# EAGLE design Qwiic_TMF8801 (EAGLE 9.6.2)
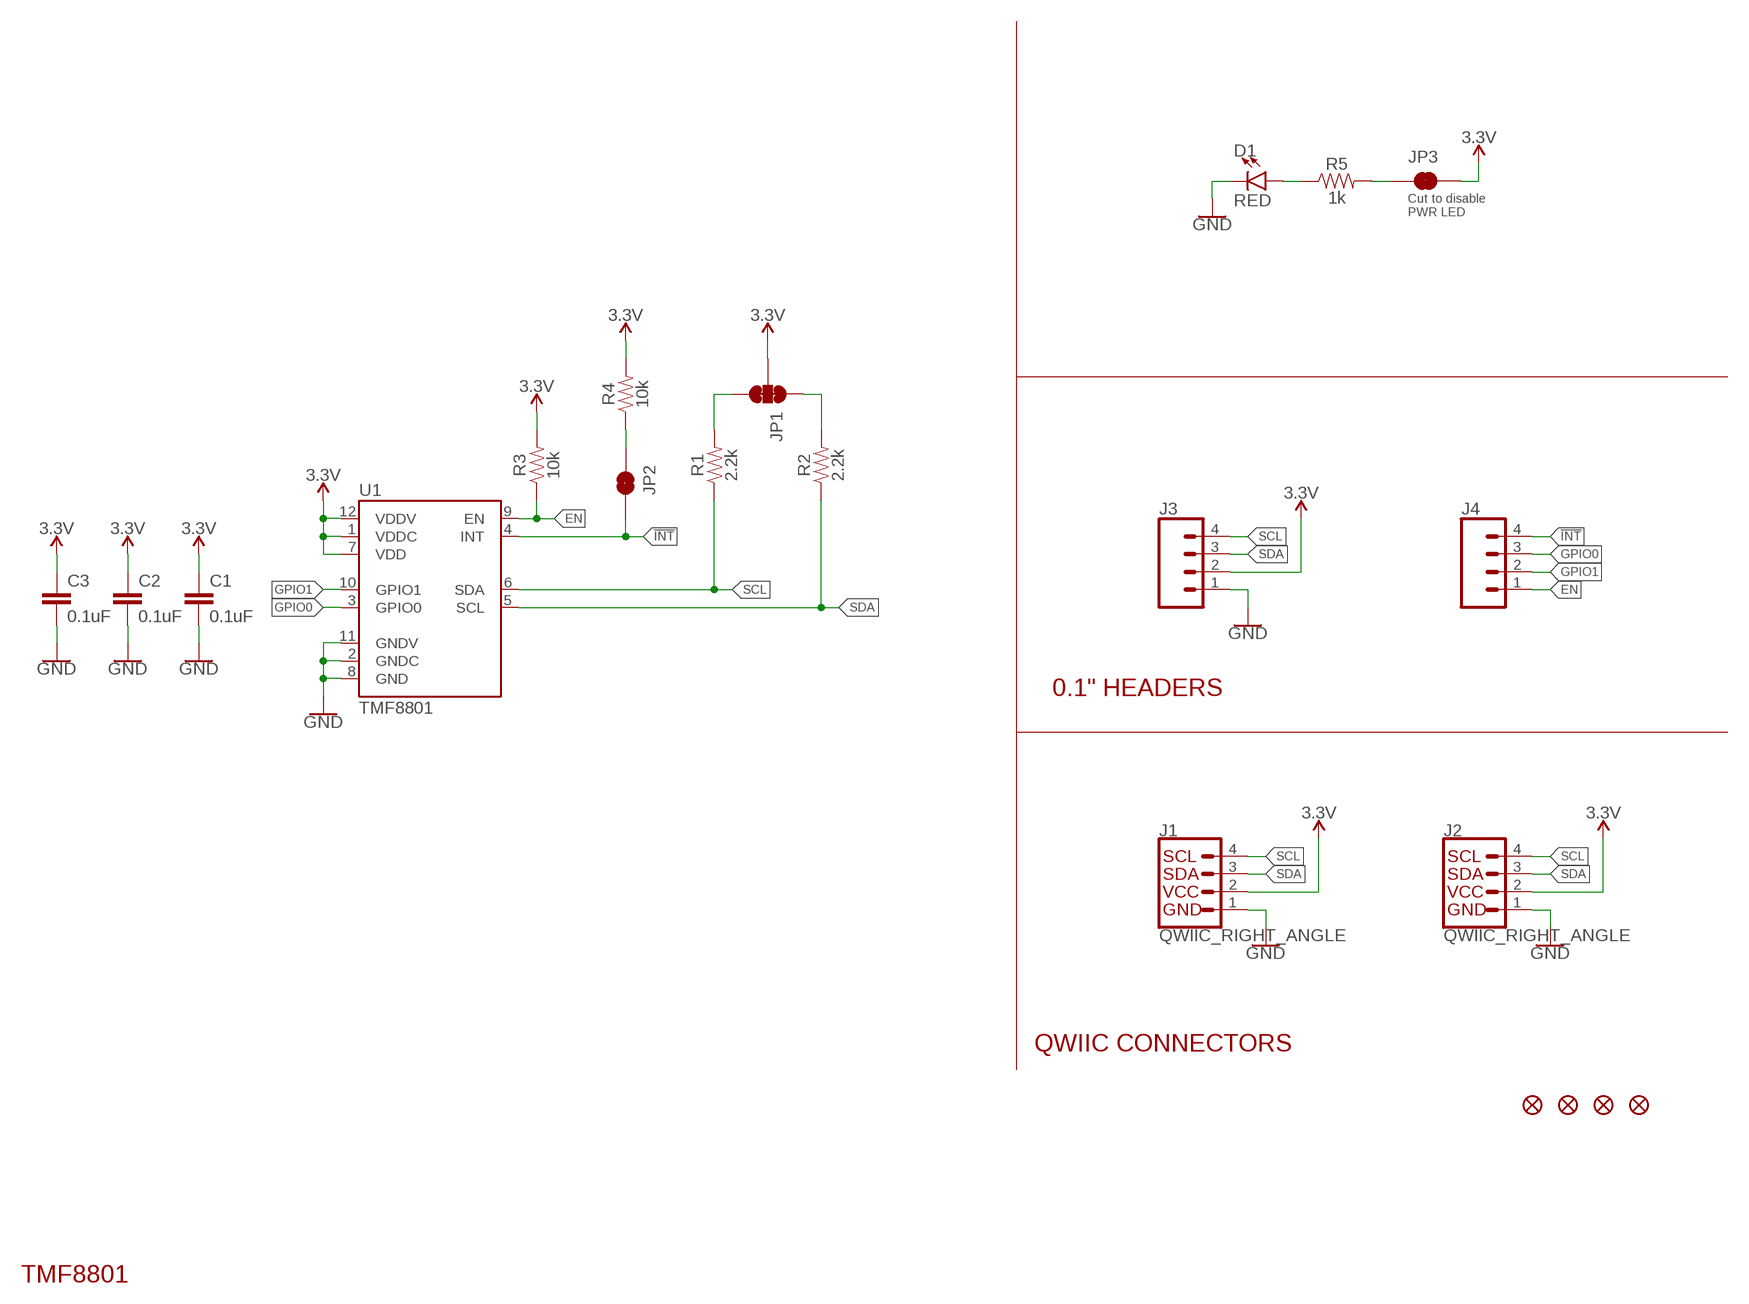
[diagram p0: schematic, sheet 1]

## Parts
C1  0.1uF  0.1UF-0603-25V-(+80/-20%)  [0603]
C2  0.1uF  0.1UF-0603-25V-(+80/-20%)  [0603]
C3  0.1uF  0.1UF-0603-25V-(+80/-20%)  [0603]
D1  RED  LED-RED0603  [LED-0603]
FD1  FIDUCIAL1X2  [FIDUCIAL-1X2]
FD2  FIDUCIAL1X2  [FIDUCIAL-1X2]
FD3  FIDUCIAL1X2  [FIDUCIAL-1X2]
FD4  FIDUCIAL1X2  [FIDUCIAL-1X2]
J1  QWIIC_RIGHT_ANGLE  QWIIC_CONNECTORJS-1MM  [JST04_1MM_RA]
J2  QWIIC_RIGHT_ANGLE  QWIIC_CONNECTORJS-1MM  [JST04_1MM_RA]
J3  CONN_041X04_NO_SILK  [1X04_NO_SILK]
J4  CONN_041X04_NO_SILK  [1X04_NO_SILK]
JP1  JUMPER-SMT_3_2-NC_TRACE_SILK  [SMT-JUMPER_3_2-NC_TRACE_SILK]
JP2  JUMPER-SMT_2_NC_TRACE_SILK  [SMT-JUMPER_2_NC_TRACE_SILK]
JP3  JUMPER-SMT_2_NC_TRACE_SILK  [SMT-JUMPER_2_NC_TRACE_SILK]
R1  2.2k  2.2KOHM-0603-1/10W-1%  [0603]
R2  2.2k  2.2KOHM-0603-1/10W-1%  [0603]
R3  10k  10KOHM-0603-1/10W-1%  [0603]
R4  10k  10KOHM-0603-1/10W-1%  [0603]
R5  1k  1KOHM-0603-1/10W-1%  [0603]
U1  TMF8801  TMF8801TMF8801  [TMF8801-CUSTOM]

## Nets
3.3V: C1.1 C2.1 C3.1 J1.2 J2.2 J3.2 JP1.2 JP3.2 R3.2 R4.2 U1.1(VDDC) U1.7(VDD) U1.12(VDDV)
!INT: J4.4 JP2.2 U1.4(INT)
EN: J4.1 R3.1 U1.9(EN)
GND: C1.2 C2.2 C3.2 D1.C J1.1 J2.1 J3.1 U1.2(GNDC) U1.8(GND) U1.11(GNDV)
GPIO0: J4.3 U1.3(GPIO0)
GPIO1: J4.2 U1.10(GPIO1)
N$1: D1.A R5.1
N$2: JP1.3 R1.2
N$3: JP1.1 R2.2
N$4: JP3.1 R5.2
N$5: JP2.1 R4.1
SCL: J1.4 J2.4 J3.4 R1.1 U1.6(SDA)
SDA: J1.3 J2.3 J3.3 R2.1 U1.5(SCL)

## Notes on the sheet
- Cut to disable
  PWR LED
- 0.1" HEADERS
- QWIIC CONNECTORS
- TMF8801

## Library data of the parts
C1-C3 = SparkFun-Capacitors:0.1UF: 0.1µF ceramic capacitors A capacitor is a passive two-terminal electrical component used to store electrical energy temporarily in an electric field.; PROD_ID: CAP-00810
D1 = SparkFun-LED:LED-RED: Red SMD LED Used in manufacturing of most products at SparkFun Packages: 0603 - SMD 0603 package [Product Link] <http://docs.avagotech.com/docs/AV02-0551EN> 0603 SMART - SMD 0603 SMART package ( more efficient and expensive)[Product Link] <http://www.osram-os.com/Graphics/XPic2/00077099_0.pdf> 1206 - SMD1206 package [Product Link] <https://www.sparkfun.com/datasheets/DevTools/LilyPad/Q150OVS4.pdff> SparkFun Products: Pro Mini 328 -5V <https://www.sparkfun.com/products/821> RedBoard <https://www.sparkfun.com/products/12757> IOIO-OTG <https://www.sparkfun.com/products/13613>; PROD_ID: DIO-00819
FD1-FD4 = SparkFun-Aesthetics:FIDUCIAL: Fiducial Alignment Points Point-of-reference for pick-and-place machines and other optical instruments.
J1 J2 = SparkFun-Connectors:QWIIC_CONNECTOR: SparkFun I2C Standard Qwiic Connector An SMD 1mm pitch JST connector makes it easy and quick (get it? Qwiic?) to connect I2C devices to each other. The Qwiic system <http://www.sparkfun.com/qwiic> enables fast and solderless connection between popular platforms and various sensors and actuators. We carry 200mm <https://www.sparkfun.com/products/14204>, 100mm <https://www.sparkfun.com/products/14205>, 50mm <https://www.sparkfun.com/products/14206>, and breadboard friendly <https://www.sparkfun.com/products/14207> Qwiic cables. We also offer 10 pcs strips <https://www.sparkfun.com/products/14323> the SMD connectors.; PROD_ID: CONN-13694
J3 J4 = SparkFun-Connectors:CONN_04: Multi connection point. Often used as Generic Header-pin footprint for 0.1 inch spaced/style header connections On any of the 0.1 inch spaced packages, you can populate with these: Break Away Headers - Straight <https://www.sparkfun.com/products/116> (PRT-00116) Break Away Male Headers - Right Angle <https://www.sparkfun.com/products/553> (PRT-00553) Female Headers <https://www.sparkfun.com/products/115> (PRT-00115) Break Away Headers - Machine Pin <https://www.sparkfun.com/products/117> (PRT-00117) Break Away Female Headers - Swiss Machine Pin <https://www.sparkfun.com/products/743> (PRT-00743) For SCREWTERMINALS and SPRING TERMINALS visit here: Screw Terimnals on SparkFun.com <https://www.sparkfun.com/search/results?term=Screw+Terminals> (5mm/3.5mm/2.54mm spacing) This device is also useful as a general connection point to wire up your design to another part of your project. Our various solder wires solder well into these plated through hole pads. Hook-Up Wire - Assortment (Stranded, 22 AWG) <https://www.sparkfun.com/products/11375> (PRT-11375) Hook-Up Wire - Assortment (Solid Core, 22 AWG) <https://www.sparkfun.com/products/11367> (PRT-11367) View the entire wire category on our website here <https://www.sparkfun.com/categories/141> Special notes: Molex polarized connector foot print use with SKU : PRT-08231 with associated crimp pins and housings. 1MM SMD Version SKU: PRT-10208; PROD_ID: CONN-09696
JP1 = SparkFun-Jumpers:JUMPER-SMT_3_2-NC_TRACE: Normally closed trace jumper (2 of 2 connections) This jumper has a trace between all three pads so they are normally closed (NC). Use a razor knife to open the connection(s). For best results follow the IPC guidelines for cutting traces: Cutout at least 0.063 mm (0.005 in). Remove all loose material to clean up the cut area. Seal the cut with an approved epoxy. Reapply solder to reclose the connection(s).
JP2 JP3 = SparkFun-Jumpers:JUMPER-SMT_2_NC_TRACE: Normally closed trace jumper This jumper has a trace between two pads so it's normally closed (NC). Use a razor knife to open the connection. For best results follow the IPC guidelines for cutting traces: Cutout at least 0.063 mm (0.005 in). Remove all loose material to clean up the cut area. Seal the cut with an approved epoxy. Reapply solder to reclose the connection.
R1 R2 = SparkFun-Resistors:2.2KOHM: 2.2kΩ resistor A resistor is a passive two-terminal electrical component that implements electrical resistance as a circuit element. Resistors act to reduce current flow, and, at the same time, act to lower voltage levels within circuits. - Wikipedia; PROD_ID: RES-08272
R3 R4 = SparkFun-Resistors:10KOHM: 10kΩ resistor A resistor is a passive two-terminal electrical component that implements electrical resistance as a circuit element. Resistors act to reduce current flow, and, at the same time, act to lower voltage levels within circuits. - Wikipedia; PROD_ID: RES-00824
R5 = SparkFun-Resistors:1KOHM: 1kΩ resistor A resistor is a passive two-terminal electrical component that implements electrical resistance as a circuit element. Resistors act to reduce current flow, and, at the same time, act to lower voltage levels within circuits. - Wikipedia; PROD_ID: RES-07856
U1 = local-ricardo:TMF8801: Time-of-Flight sensor

## Net classes
1 Power: width 0.305 mm

## Board
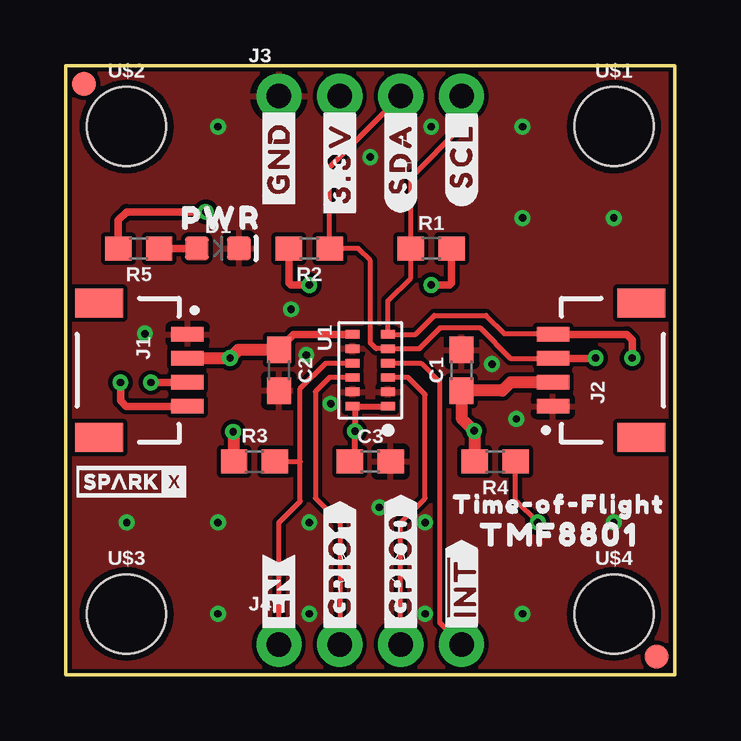
[diagram p1: board, top side]
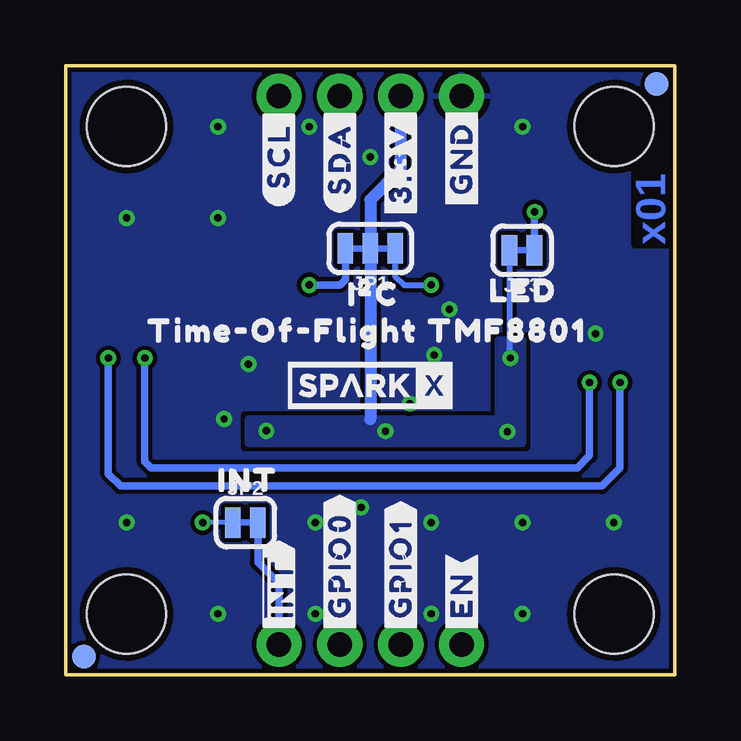
[diagram p2: board, bottom side, seen from below]

Size 25.4 x 25.4 mm. Coordinates in mm from the lower left corner, seen from the top.
Outline: 0,0 25.4,0 25.4,25.4 0,25.4 0,0
Copper layers (1*16): Top 0.035mm / dielectric 1.5mm / Bottom 0.035mm
Design rules "SparkFun-2-layer-TIGHT *": minimum track width 7mil, minimum drill 12mil, track to track 7mil, track to pad 7mil, pad to pad 7mil, via to via 7mil, smd to smd 7mil, copper to edge 7mil, drill to drill 7mil, minimum pad ring 7mil, minimum via ring 7mil, stop-mask expansion 4mil, vias tented up to drill 25mil, thermal gap 10mil

### Footprints (pad centres in the part's own frame; a part is rotated, then mirrored left to right if it is on the bottom)
0603 = smd 1.1 x 1: 1 -0.85,0; 2 0.85,0
LED-0603 = smd 1 x 1: A -0.877,0; C 0.877,0
FIDUCIAL-1X2 = smd 1 x 1: 1 0,0
JST04_1MM_RA = smd 0.6 x 1.35: 1 -1.5,0; 2 -0.5,0; 3 0.5,0; 4 1.5,0 | smd 1.2 x 2: NC1 2.8,-3.675; NC2 -2.8,-3.675
1X04_NO_SILK = drill 1.016 pad 1.88: 1 0,0; 2 2.54,0; 3 5.08,0; 4 7.62,0
SMT-JUMPER_3_2-NC_TRACE_SILK = smd 0.66 x 1.27: 1 -1.041,0; 2 0,0; 3 1.041,0
SMT-JUMPER_2_NC_TRACE_SILK = smd 0.66 x 1.27: 1 -0.521,0; 2 0.521,0
TMF8801-CUSTOM = smd 0.35 x 0.575: 1 -1.5,-0.738; 2 -0.9,-0.738; 3 -0.3,-0.738; 4 0.3,-0.738; 5 0.9,-0.738; 6 1.5,-0.738; 7 1.5,0.738; 8 0.9,0.738; 9 0.3,0.738; 10 -0.3,0.738; 11 -0.9,0.738; 12 -1.5,0.738
STAND-OFF = hole 3.302: 0,0

### Placement (x,y rotation side)
C1  16.51,12.7 90 top
C2  8.89,12.7 270 top
C3  12.7,8.89 0 top
D1  6.35,17.78 0 top
FD1  0.76,24.64 0 top
FD2  0.76,24.64 0 bottom
FD3  24.64,0.76 0 top
FD4  24.64,0.76 0 bottom
FRAME1  FRAME-LETTERNO_PACKAGE  [DUMMY]  -0.25,-0.51 0 top
J1  Qwiic  [JST04_1MM_RA]  5.08,12.7 270 top
J2  Qwiic  [JST04_1MM_RA]  20.32,12.7 90 top
J3  8.89,24.13 0 top
J4  8.89,1.27 0 top
JP1  12.7,17.78 180 bottom
JP2  17.91,6.35 0 bottom
JP3  6.38,17.7 180 bottom
R1  15.24,17.78 0 top
R2  10.16,17.78 180 top
R3  7.87,8.89 180 top
R4  17.91,8.89 180 top
R5  3.05,17.78 180 top
U1  12.7,12.7 90 top
U$1  [STAND-OFF]  22.86,22.86 0 top
U$2  [STAND-OFF]  2.54,22.86 0 top
U$3  [STAND-OFF]  2.54,2.54 0 top
U$4  [STAND-OFF]  22.86,2.54 0 top
U$5  [#3#3V#1]  11.43,18.92 90 top
U$6  [#SDA#4]  13.97,19.3 90 top
U$7  [#GND#0]  8.89,19.3 90 top
U$8  [##INT##7]  16.52,1.67 90 top
U$9  [#GPIO0#7]  13.97,1.65 90 top
U$10  [#GPIO1#7]  11.43,1.65 90 top
U$11  [#EN#6]  8.89,1.65 90 top
U$12  [#INT0]  17.78,8.26 0 bottom
U$13  [TMF88010]  20.57,5.84 0 top
U$14  [TIME#OF#FLIGHT0]  20.57,7.11 0 top
U$16  [TIME#OF#FLIGHT_TMF88018]  12.83,14.35 0 bottom
U$17  [#3#3V#1]  11.43,18.92 90 bottom
U$18  [#GND#0]  8.89,19.3 90 bottom
U$19  [#SDA#4]  13.97,19.3 90 bottom
U$20  [SPARKX-TINY]  2.74,8.05 0 top
U$21  [#SCL#5]  16.51,19.56 90 top
U$22  [#SCL#5]  16.51,19.56 90 bottom
U$23  [#EN#6]  8.89,1.65 90 bottom
U$24  [##INT##7]  16.51,1.65 90 bottom
U$25  [#GPIO0#7]  13.97,1.65 90 bottom
U$26  [#GPIO1#7]  11.43,1.65 90 bottom
U$27  [SPARKX-SMALL]  12.7,12.06 0 bottom
U$28  [I�C0]  12.57,15.88 0 bottom
U$29  [LED1]  6.32,16.03 0 bottom
U$30  [PWR2]  6.48,19.05 0 top

### Tracks (layer width: path | path; a pad name or v marks a point on that pad's centre or on a via)
3.3V  (via drill 0.3)
  Top 0.254: U1.1 U1.12 12.06,11.1 v12.06,10.16 12.06,9.11 C3.1
  Top 0.305: 11.96,9 C3.1 | U1.7 9.5,14.2 8.89,13.59 C2.1
  Top 0.508: R3.2 7.02,10.15 7.01,10.16 v6.99,10.13 | J2.2 18.55,12.2 18.2,11.85 C1.1 16.51,10.69 v17.03,10.17 17.07,10.13 17.06,10.12 R4.2 | J1.2 v6.86,13.21 7.2,13.55 C2.1
  Bottom 0.254: JP3.2 6.9,13.25 v6.86,13.21
  Bottom 0.508: 12.7,10.67 JP1.2 12.7,19.81 11.43,21.08 J3.2
  pour Bottom: 6.35,13.97 6.35,9.65 17.78,9.65 17.78,10.67 7.37,10.67 7.37,13.97
!INT
  Top 0.203: U1.4 14.81,13 15.6,12.22 15.6,2.18 J4.4
  Bottom 0.305: JP2.2 17.39,4.69 16.51,3.81 J4.4
EN
  Top 0.203: J4.1 8.89,6.35 9.78,7.24 9.78,8.89 | U1.9 10.85,13 9.78,11.93 9.78,8.89 | R3.1 9.78,8.89
GND  (via drill 0.3)
  other vias: 9.4,15.24 22.86,6.35 19.05,2.54 6.35,2.54 6.35,6.35 2.54,6.35 19.05,19.05 22.86,19.05 18.8,10.67 19.05,22.86 6.35,22.86 14.99,2.54 14.99,6.35 10.16,6.35 10.16,2.54 15.24,22.86 12.7,21.59 17.78,12.95 13.08,6.99 11.05,11.3 10.03,13.34 3.3,14.22
  pour Top: 0,25.4 25.4,25.4 25.4,0 0,0
  pour Bottom (rank 2): 0,0 25.4,0 25.4,25.4 0,25.4
GPIO0
  Top 0.203: J4.3 13.97,6.35 14.99,7.37 14.99,11.68 14.27,12.4 U1.3
GPIO1
  Top 0.203: U1.10 11,12.4 10.41,11.81 10.41,7.37 11.43,6.35 J4.2
N$1
  Top 0.305: D1.A R5.1
N$2  (via drill 0.3)
  Top 0.305: R1.2 16.09,16.34 16,16.26 v15.24,16.26
  Bottom 0.305: JP1.3 13.74,16.48 13.97,16.26 v15.24,16.26
N$3  (via drill 0.3)
  Top 0.305: R2.2 9.31,16.34 9.4,16.26 v10.16,16.26
  Bottom 0.254: JP1.1 11.66,16.61 11.3,16.26 v10.16,16.26
N$4  (via drill 0.3)
  Top 0.305: R5.2 2.2,18.96 2.54,19.3 v5.84,19.3
  Bottom 0.305: v5.84,19.3 5.86,19.29 JP3.1
N$5  (via drill 0.3)
  Top 0.203: v19.68,6.35 18.76,7.28 R4.1
  Bottom 0.203: JP2.1 v19.68,6.35
SCL  (via drill 0.3)
  Top 0.203: J2.4 20.3,14.22 18.29,14.22 17.53,14.99 15.37,14.99 14.58,14.2 U1.6 13.44,15.6 14.39,16.55 R1.1 14.39,20.74 16.51,22.86 J3.4
  Top 0.305: J1.4 2.52,11.2 2.29,11.43 v2.29,12.19 | J2.4 23.39,14.2 23.62,13.97 v23.62,13.21
  Bottom 0.305: v2.29,12.19 2.29,8.64 3.05,7.87 23.11,7.87 23.62,8.38 v23.62,13.21
SDA  (via drill 0.3)
  Top 0.203: J2.3 18.55,13.2 17.27,14.48 15.62,14.48 14.74,13.6 U1.5 12.94,13.6 12.7,13.84 12.7,17.27 12.19,17.78 R2.1 11.01,21.17 J3.3
  Top 0.305: J1.3 v3.56,12.19 | v22.1,13.21 v22.09,13.2 J2.3
  Bottom 0.305: v3.56,12.19 3.56,9.14 4.06,8.64 21.84,8.64 22.1,8.89 v22.1,13.21

### Text on the board
Bottom: x01
_tNames: U$2 | J3 | U$1 | R4 | R3 | D1 | C1 | J1 | U1 | C2 | C3 | J2 | R2 | R1 | U$3 | U$4 | J4
_bNames: JP2 | JP1